# EAGLE schematic Harms Professional RAM-16-4a (EAGLE 6.6.0)
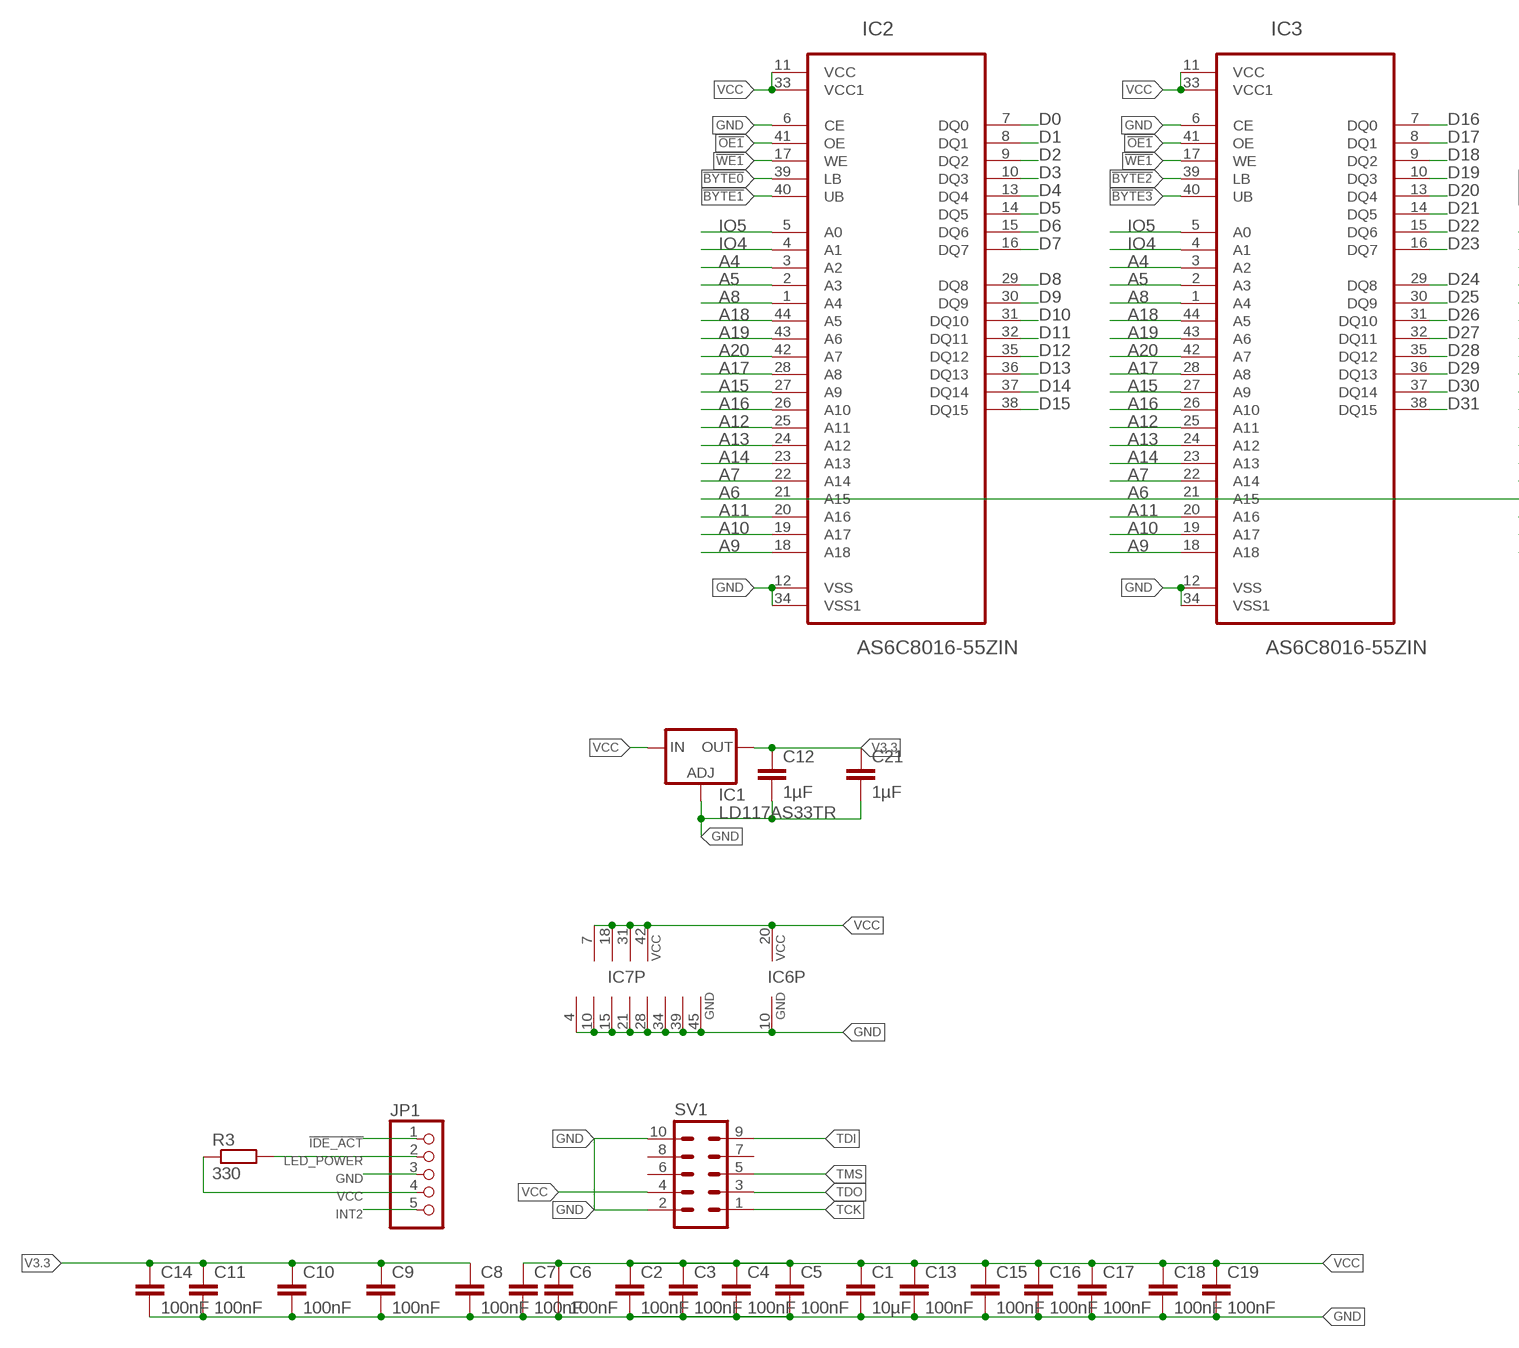
[diagram p0: schematic, sheet 1, part 1 of 2]
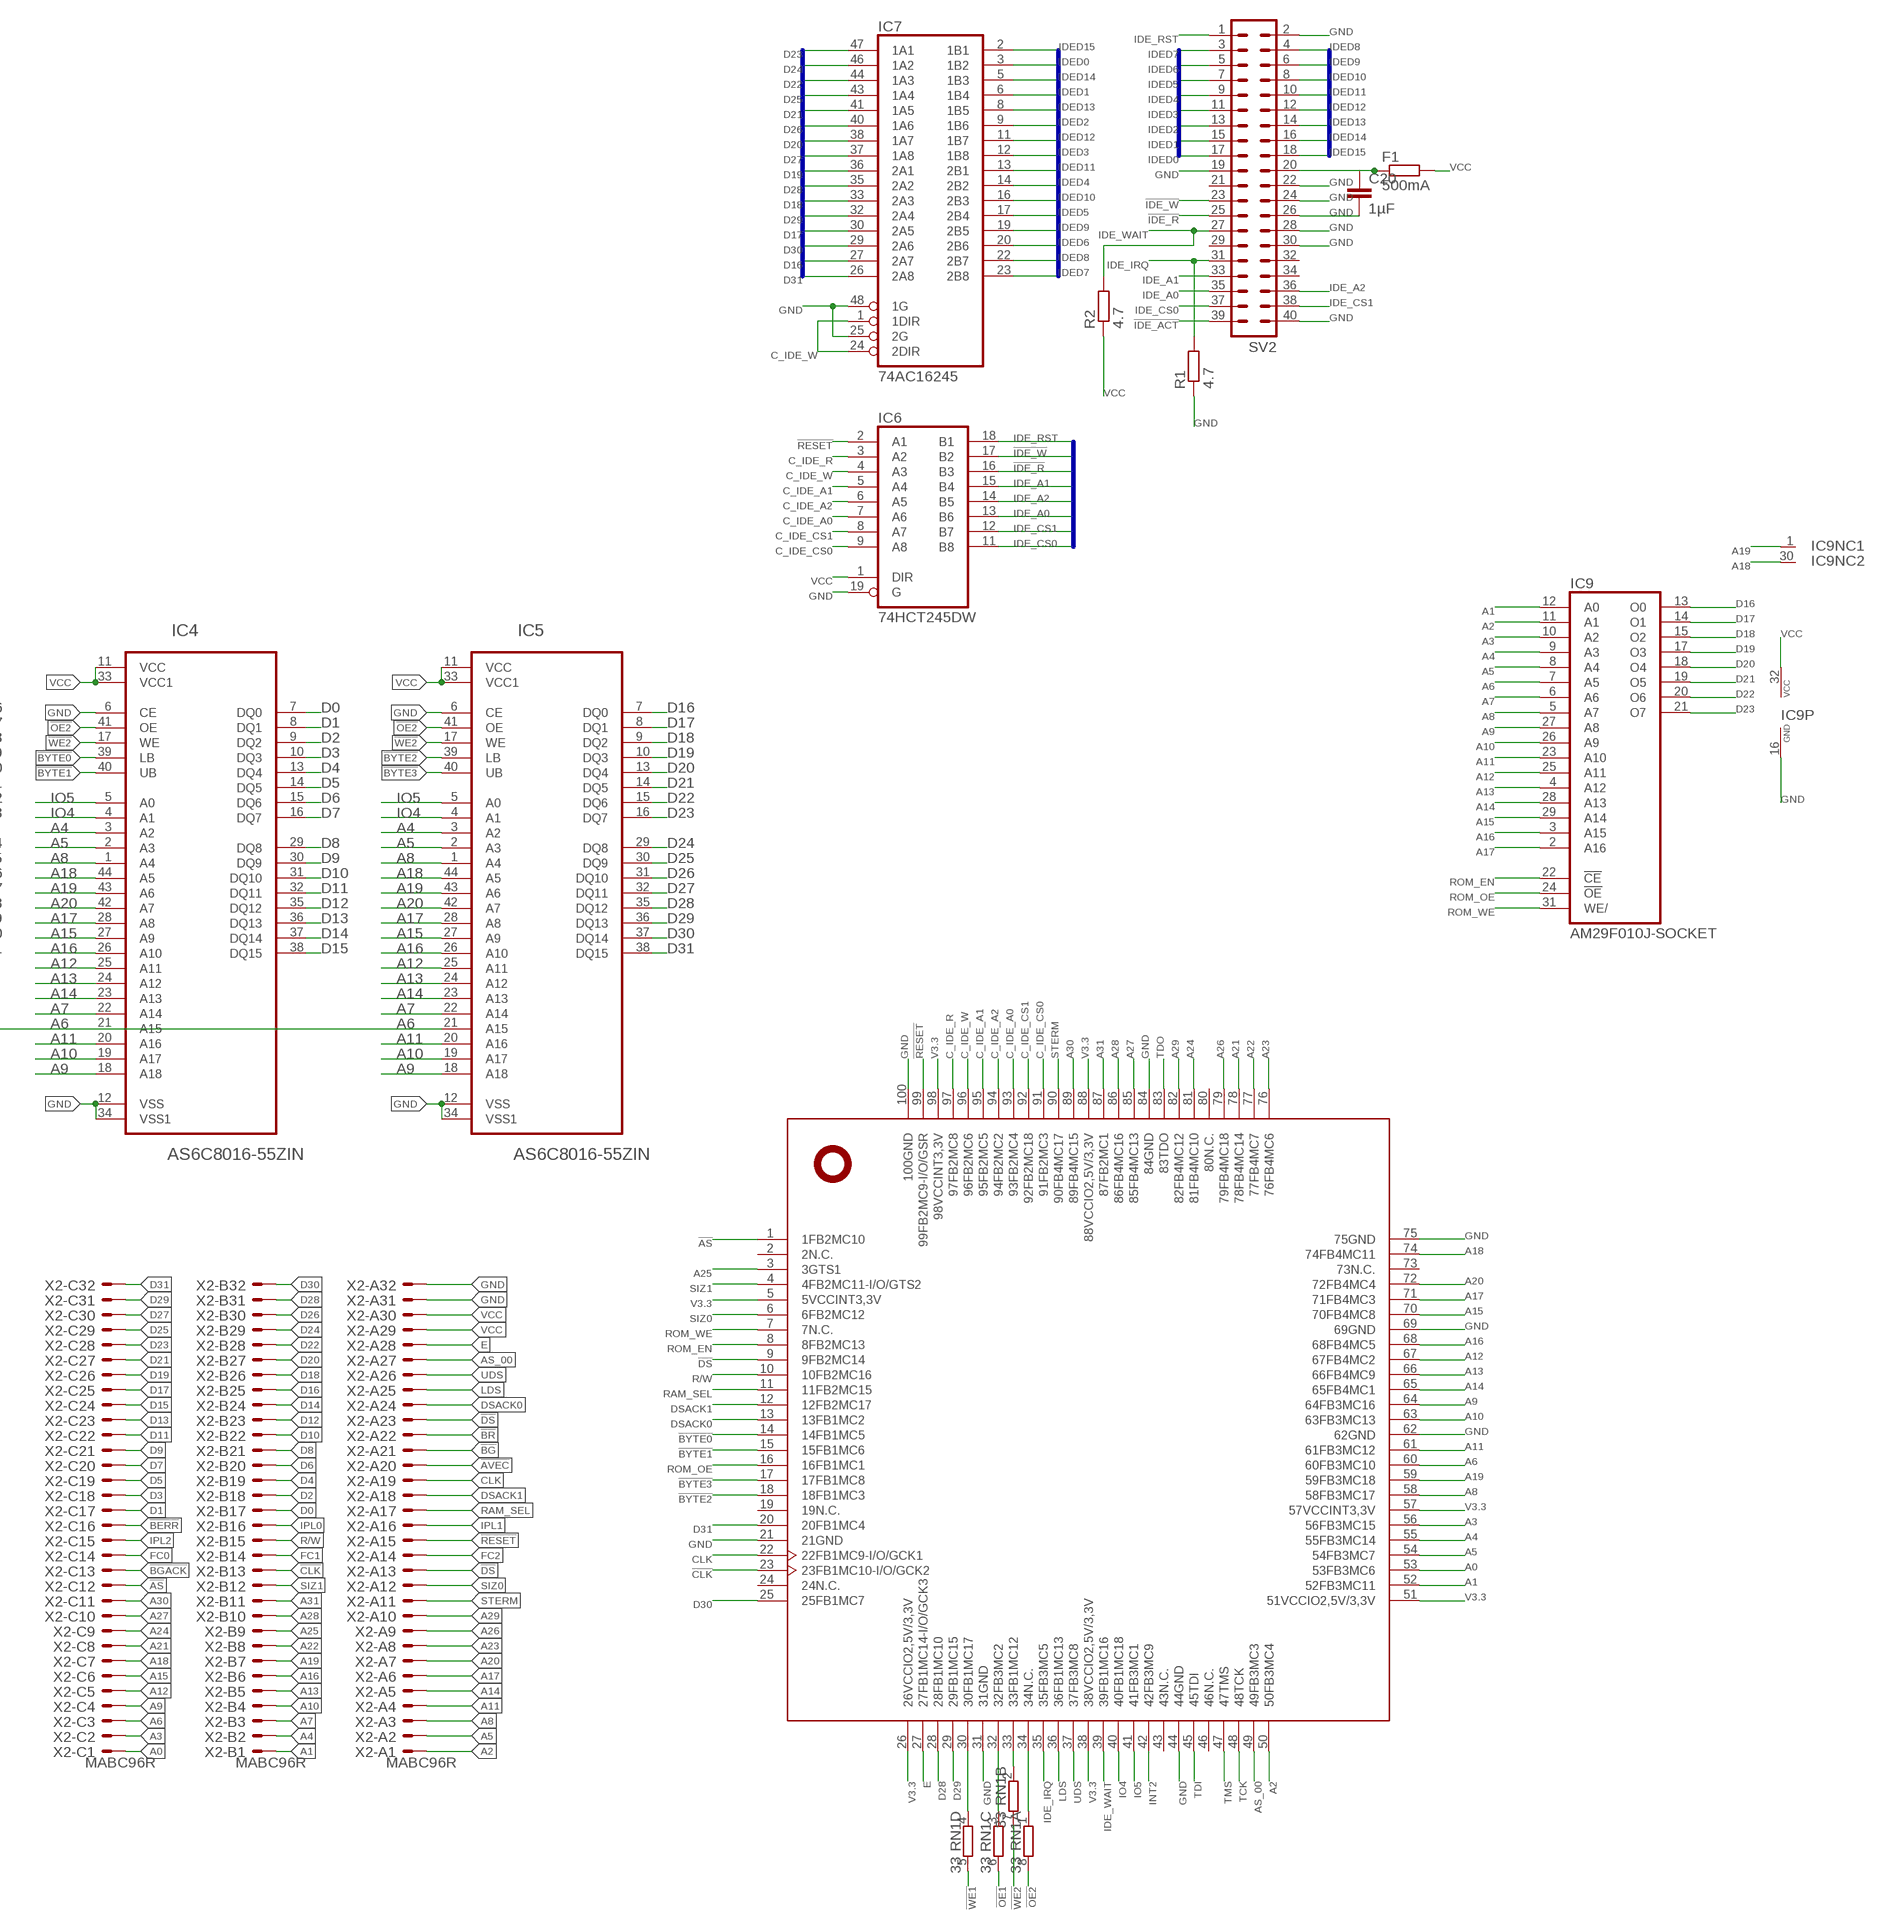
[diagram p1: schematic, sheet 1, part 2 of 2]

## Parts
C1  10µF  C-EUC0805K  [C0805K]
C2  100nF  C-EUC0603K  [C0603K]
C3  100nF  C-EUC0603K  [C0603K]
C4  100nF  C-EUC0603K  [C0603K]
C5  100nF  C-EUC0603K  [C0603K]
C6  100nF  C-EUC0603K  [C0603K]
C7  100nF  C-EUC0603K  [C0603K]
C8  100nF  C-EUC0603K  [C0603K]
C9  100nF  C-EUC0603K  [C0603K]
C10  100nF  C-EUC0603K  [C0603K]
C11  100nF  C-EUC0603K  [C0603K]
C12  1µF  C-EUC0805K  [C0805K]
C13  100nF  C-EUC0603K  [C0603K]
C14  100nF  C-EUC0603K  [C0603K]
C15  100nF  C-EUC0603K  [C0603K]
C16  100nF  C-EUC0603K  [C0603K]
C17  100nF  C-EUC0603K  [C0603K]
C18  100nF  C-EUC0603K  [C0603K]
C19  100nF  C-EUC0603K  [C0603K]
C20  1µF  C-EUC0805K  [C0805K]
C21  1µF  C-EUC0805K  [C0805K]
F1  500mA  R-EU_R2512  [R2512]
IC1  LD117AS33TR  [SOT223]
IC2  AS6C8016-55ZIN  [TSOP-2_44]
IC3  AS6C8016-55ZIN  [TSOP-2_44]
IC4  AS6C8016-55ZIN  [TSOP-2_44]
IC5  AS6C8016-55ZIN  [TSOP-2_44]
IC6  74HCT245DW  [SO20W]
IC7  74AC16245  [SSOP48DL]
IC9  AM29F010J-SOCKET  [PLCC-32-SMT-TT]
IC10  XC9572XLTQ100  [TQ100]
JP1  PINHD-1X5  [1X05]
R1  4.7  R-EU_R0603  [R0603]
R2  4.7  R-EU_R0603  [R0603]
R3  330  R-EU_R0603  [R0603]
RN1  33  4R-NCAY16  [CAY16]
SV1  ML10  [ML10]
SV2  ML40  [ML40]
X2  MABC96R  [MABC96R]

## Nets
!AS: IC10.1(1FB2MC10) X2.C12
!AVEC: X2.A20
!BERR: X2.C16
!BG: X2.A21
!BGACK: X2.C13
!BR: X2.A22
!BYTE0: IC2.39(LB) IC4.39(LB) IC10.14(14FB1MC5)
!BYTE1: IC2.40(UB) IC4.40(UB) IC10.15(15FB1MC6)
!BYTE2: IC3.39(LB) IC5.39(LB) IC10.18(18FB1MC3)
!BYTE3: IC3.40(UB) IC5.40(UB) IC10.17(17FB1MC8)
!CLK: IC10.23(23FB1MC10-I/O/GCK2) X2.B13
!DS: IC10.9(9FB2MC14) X2.A13 X2.A23
!IDE_ACT: JP1.1 SV2.39
!IDE_R: IC6.16(B3) SV2.25
!IDE_W: IC6.17(B2) SV2.23
!OE1: IC2.41(OE) IC3.41(OE) RN1.6
!OE2: IC4.41(OE) IC5.41(OE) RN1.8
!RESET: IC6.2(A1) IC10.99(99FB2MC9-I/O/GSR) X2.A15
!WE1: IC2.17(WE) IC3.17(WE) RN1.5
!WE2: IC4.17(WE) IC5.17(WE) RN1.7
A0: IC10.53(53FB3MC6) X2.C1
A1: IC9.12(A0) IC10.52(52FB3MC11) X2.B1
A2: IC9.11(A1) IC10.50(50FB3MC4) X2.A1
A3: IC9.10(A2) IC10.56(56FB3MC15) X2.C2
A4: IC2.3(A2) IC3.3(A2) IC4.3(A2) IC5.3(A2) IC9.9(A3) IC10.55(55FB3MC14) X2.B2
A5: IC2.2(A3) IC3.2(A3) IC4.2(A3) IC5.2(A3) IC9.8(A4) IC10.54(54FB3MC7) X2.A2
A6: IC2.21(A15) IC3.21(A15) IC4.21(A15) IC5.21(A15) IC9.7(A5) IC10.60(60FB3MC10) X2.C3
A7: IC2.22(A14) IC3.22(A14) IC4.22(A14) IC5.22(A14) IC9.6(A6) X2.B3
A8: IC2.1(A4) IC3.1(A4) IC4.1(A4) IC5.1(A4) IC9.5(A7) IC10.58(58FB3MC17) X2.A3
A9: IC2.18(A18) IC3.18(A18) IC4.18(A18) IC5.18(A18) IC9.27(A8) IC10.64(64FB3MC16) X2.C4
A10: IC2.19(A17) IC3.19(A17) IC4.19(A17) IC5.19(A17) IC9.26(A9) IC10.63(63FB3MC13) X2.B4
A11: IC2.20(A16) IC3.20(A16) IC4.20(A16) IC5.20(A16) IC9.23(A10) IC10.61(61FB3MC12) X2.A4
A12: IC2.25(A11) IC3.25(A11) IC4.25(A11) IC5.25(A11) IC9.25(A11) IC10.67(67FB4MC2) X2.C5
A13: IC2.24(A12) IC3.24(A12) IC4.24(A12) IC5.24(A12) IC9.4(A12) IC10.66(66FB4MC9) X2.B5
A14: IC2.23(A13) IC3.23(A13) IC4.23(A13) IC5.23(A13) IC9.28(A13) IC10.65(65FB4MC1) X2.A5
A15: IC2.27(A9) IC3.27(A9) IC4.27(A9) IC5.27(A9) IC9.29(A14) IC10.70(70FB4MC8) X2.C6
A16: IC2.26(A10) IC3.26(A10) IC4.26(A10) IC5.26(A10) IC9.3(A15) IC10.68(68FB4MC5) X2.B6
A17: IC2.28(A8) IC3.28(A8) IC4.28(A8) IC5.28(A8) IC9.2(A16) IC10.71(71FB4MC3) X2.A6
A18: IC2.44(A5) IC3.44(A5) IC4.44(A5) IC5.44(A5) IC9.30(NC) IC10.74(74FB4MC11) X2.C7
A19: IC2.43(A6) IC3.43(A6) IC4.43(A6) IC5.43(A6) IC9.1(NC) IC10.59(59FB3MC18) X2.B7
A20: IC2.42(A7) IC3.42(A7) IC4.42(A7) IC5.42(A7) IC10.72(72FB4MC4) X2.A7
A21: IC10.78(78FB4MC14) X2.C8
A22: IC10.77(77FB4MC7) X2.B8
A23: IC10.76(76FB4MC6) X2.A8
A24: IC10.81(81FB4MC10) X2.C9
A25: IC10.3(3GTS1) X2.B9
A26: IC10.79(79FB4MC18) X2.A9
A27: IC10.85(85FB4MC13) X2.C10
A28: IC10.86(86FB4MC16) X2.B10
A29: IC10.82(82FB4MC12) X2.A10
A30: IC10.89(89FB4MC15) X2.C11
A31: IC10.87(87FB2MC1) X2.B11
AS_00: IC10.49(49FB3MC3) X2.A27
C_IDE_A0: IC6.7(A6) IC10.93(93FB2MC4)
C_IDE_A1: IC6.5(A4) IC10.95(95FB2MC5)
C_IDE_A2: IC6.6(A5) IC10.94(94FB2MC2)
C_IDE_CS0: IC6.9(A8) IC10.91(91FB2MC3)
C_IDE_CS1: IC6.8(A7) IC10.92(92FB2MC18)
C_IDE_R: IC6.3(A2) IC10.97(97FB2MC8)
C_IDE_W: IC6.4(A3) IC7.1(1DIR) IC7.24(2DIR) IC10.96(96FB2MC6)
CLK: IC10.22(22FB1MC9-I/O/GCK1) X2.A19
D0: IC2.7(DQ0) IC4.7(DQ0) X2.B17
D1: IC2.8(DQ1) IC4.8(DQ1) X2.C17
D2: IC2.9(DQ2) IC4.9(DQ2) X2.B18
D3: IC2.10(DQ3) IC4.10(DQ3) X2.C18
D4: IC2.13(DQ4) IC4.13(DQ4) X2.B19
D5: IC2.14(DQ5) IC4.14(DQ5) X2.C19
D6: IC2.15(DQ6) IC4.15(DQ6) X2.B20
D7: IC2.16(DQ7) IC4.16(DQ7) X2.C20
D8: IC2.29(DQ8) IC4.29(DQ8) X2.B21
D9: IC2.30(DQ9) IC4.30(DQ9) X2.C21
D10: IC2.31(DQ10) IC4.31(DQ10) X2.B22
D11: IC2.32(DQ11) IC4.32(DQ11) X2.C22
D12: IC2.35(DQ12) IC4.35(DQ12) X2.B23
D13: IC2.36(DQ13) IC4.36(DQ13) X2.C23
D14: IC2.37(DQ14) IC4.37(DQ14) X2.B24
D15: IC2.38(DQ15) IC4.38(DQ15) X2.C24
D16: IC3.7(DQ0) IC5.7(DQ0) IC7.27(2A7) IC9.13(O0) X2.B25
D17: IC3.8(DQ1) IC5.8(DQ1) IC7.30(2A5) IC9.14(O1) X2.C25
D18: IC3.9(DQ2) IC5.9(DQ2) IC7.33(2A3) IC9.15(O2) X2.B26
D19: IC3.10(DQ3) IC5.10(DQ3) IC7.36(2A1) IC9.17(O3) X2.C26
D20: IC3.13(DQ4) IC5.13(DQ4) IC7.38(1A7) IC9.18(O4) X2.B27
D21: IC3.14(DQ5) IC5.14(DQ5) IC7.41(1A5) IC9.19(O5) X2.C27
D22: IC3.15(DQ6) IC5.15(DQ6) IC7.44(1A3) IC9.20(O6) X2.B28
D23: IC3.16(DQ7) IC5.16(DQ7) IC7.47(1A1) IC9.21(O7) X2.C28
D24: IC3.29(DQ8) IC5.29(DQ8) IC7.46(1A2) X2.B29
D25: IC3.30(DQ9) IC5.30(DQ9) IC7.43(1A4) X2.C29
D26: IC3.31(DQ10) IC5.31(DQ10) IC7.40(1A6) X2.B30
D27: IC3.32(DQ11) IC5.32(DQ11) IC7.37(1A8) X2.C30
D28: IC3.35(DQ12) IC5.35(DQ12) IC7.35(2A2) IC10.28(28FB1MC10) X2.B31
D29: IC3.36(DQ13) IC5.36(DQ13) IC7.32(2A4) IC10.29(29FB1MC15) X2.C31
D30: IC3.37(DQ14) IC5.37(DQ14) IC7.29(2A6) IC10.25(25FB1MC7) X2.B32
D31: IC3.38(DQ15) IC5.38(DQ15) IC7.26(2A8) IC10.20(20FB1MC4) X2.C32
DSACK0: IC10.13(13FB1MC2) X2.A24
DSACK1: IC10.12(12FB2MC17) X2.A18
E: IC10.27(27FB1MC14-I/O/GCK3) X2.A28
FC0: X2.C14
FC1: X2.B14
FC2: X2.A14
GND: C1.2 C2.2 C3.2 C4.2 C5.2 C6.2 C7.2 C8.2 C9.2 C10.2 C11.2 C12.2 C13.2 C14.2 C15.2 C16.2 C17.2 C18.2 C19.2 C20.2 C21.2 IC1.1(ADJ) IC2.6(CE) IC2.12(VSS) IC2.34(VSS1) IC3.6(CE) IC3.12(VSS) IC3.34(VSS1) IC4.6(CE) IC4.12(VSS) IC4.34(VSS1) IC5.6(CE) IC5.12(VSS) IC5.34(VSS1) IC6.10(GND) IC6.19(G) IC7.4(GND) IC7.10(GND) IC7.15(GND) IC7.21(GND) IC7.25(2G) IC7.28(GND) IC7.34(GND) IC7.39(GND) IC7.45(GND) IC7.48(1G) IC9.16(GND) IC10.21(21GND) IC10.31(31GND) IC10.44(44GND) IC10.62(62GND) IC10.69(69GND) IC10.75(75GND) IC10.84(84GND) IC10.100(100GND) JP1.3 R1.1 SV1.2 SV1.10 SV2.2 SV2.19 SV2.22 SV2.24 SV2.26 SV2.28 SV2.30 SV2.40 X2.A31 X2.A32
IDE_A0: IC6.13(B6) SV2.35
IDE_A1: IC6.15(B4) SV2.33
IDE_A2: IC6.14(B5) SV2.36
IDE_CS0: IC6.11(B8) SV2.37
IDE_CS1: IC6.12(B7) SV2.38
IDE_IRQ: IC10.35(35FB3MC5) R1.2 SV2.31
IDE_RST: IC6.18(B1) SV2.1
IDE_WAIT: IC10.39(39FB1MC16) R2.2 SV2.27
IDED0: IC7.3(1B2) SV2.17
IDED1: IC7.6(1B4) SV2.15
IDED2: IC7.9(1B6) SV2.13
IDED3: IC7.12(1B8) SV2.11
IDED4: IC7.14(2B2) SV2.9
IDED5: IC7.17(2B4) SV2.7
IDED6: IC7.20(2B6) SV2.5
IDED7: IC7.23(2B8) SV2.3
IDED8: IC7.22(2B7) SV2.4
IDED9: IC7.19(2B5) SV2.6
IDED10: IC7.16(2B3) SV2.8
IDED11: IC7.13(2B1) SV2.10
IDED12: IC7.11(1B7) SV2.12
IDED13: IC7.8(1B5) SV2.14
IDED14: IC7.5(1B3) SV2.16
IDED15: IC7.2(1B1) SV2.18
INT2: IC10.42(42FB3MC9) JP1.5
IO4: IC2.4(A1) IC3.4(A1) IC4.4(A1) IC5.4(A1) IC10.40(40FB1MC18)
IO5: IC2.5(A0) IC3.5(A0) IC4.5(A0) IC5.5(A0) IC10.41(41FB3MC1)
IPL0: X2.B16
IPL1: X2.A16
IPL2: X2.C15
KEY_PIN_POWER: C20.1 F1.1 SV2.20
LDS: IC10.36(36FB1MC13) X2.A25
LED_POWER: JP1.2 R3.2
N$1: IC10.30(30FB1MC17) RN1.4
N$2: IC10.34(34N.C.) RN1.1
N$3: IC10.33(33FB1MC12) RN1.2
N$4: IC10.32(32FB3MC2) RN1.3
R/W: IC10.10(10FB2MC16) X2.B15
RAM_SEL: IC10.11(11FB2MC15) X2.A17
ROM_EN: IC9.22(!CE) IC10.8(8FB2MC13)
ROM_OE: IC9.24(!OE) IC10.16(16FB1MC1)
ROM_WE: IC9.31(WE/) IC10.7(7N.C.)
SIZ0: IC10.6(6FB2MC12) X2.A12
SIZ1: IC10.4(4FB2MC11-I/O/GTS2) X2.B12
STERM: IC10.90(90FB4MC17) X2.A11
TCK: IC10.48(48TCK) SV1.1
TDI: IC10.45(45TDI) SV1.9
TDO: IC10.83(83TDO) SV1.3
TMS: IC10.47(47TMS) SV1.5
UDS: IC10.37(37FB3MC8) X2.A26
V3.3: C8.1 C9.1 C10.1 C11.1 C12.1 C14.1 C21.1 IC1.4(OUT) IC10.5(5VCCINT3,3V) IC10.26(26VCCIO2,5V/3,3V) IC10.38(38VCCIO2,5V/3,3V) IC10.51(51VCCIO2,5V/3,3V) IC10.57(57VCCINT3,3V) IC10.88(88VCCIO2,5V/3,3V) IC10.98(98VCCINT3,3V)
VCC: C1.1 C2.1 C3.1 C4.1 C5.1 C6.1 C7.1 C13.1 C15.1 C16.1 C17.1 C18.1 C19.1 F1.2 IC1.3(IN) IC2.11(VCC) IC2.33(VCC1) IC3.11(VCC) IC3.33(VCC1) IC4.11(VCC) IC4.33(VCC1) IC5.11(VCC) IC5.33(VCC1) IC6.1(DIR) IC6.20(VCC) IC7.7(VCC) IC7.18(VCC) IC7.31(VCC) IC7.42(VCC) IC9.32(VCC) JP1.4 R2.1 R3.1 SV1.4 X2.A29 X2.A30
Unconnected: IC10.2(2N.C.) IC10.19(19N.C.) IC10.24(24N.C.) IC10.43(43N.C.) IC10.46(46N.C.) IC10.73(73N.C.) IC10.80(80N.C.) SV1.6 SV1.7 SV1.8 SV2.21 SV2.29 SV2.32 SV2.34

## Buses
IDED[0..15]
D[0..31]
IDE_RST,IDE_A[0..2],IDE_CS[0..1],!IDE_R,!IDE_W

## Library data of the parts
C1-C21 = rcl:C-EU: CAPACITOR, European symbol
F1 R1-R3 = rcl:R-EU_: RESISTOR, European symbol
IC1 = v-reg:LD117A?*: Low drop fixed and adjustable positive voltage regulators 1 A Source: http://www.st.com/stonline/products/literature/ds/7194/ld1117axx.pdf
IC2-IC5 = Alliance_Memory_By_element14_Batch_1:AS6C8016-55ZIN
IC6 = 74xx-eu:74*245: Octal BUS TRANSCEIVER, 3-state
IC7 = 74ac-logic:74AC16245: 16-bit BUS TRANSCEIVER, 3-state
IC9 = am29-memory:AM29F010*: 1-Megabit FLASH MEMORY (128 K x 8 bit) 5 V-only
IC10 = xilinx_xc9572xl-tq100:XC9572XLTQ100
JP1 = pinhead:PINHD-1X5: PIN HEADER
RN1 = resistor-dil:4R-N: Array Chip Resistor Source: RS Component / Phycomp; OC_FARNELL: unknown; OC_NEWARK: unknown
SV1 = con-harting-ml:ML10: HARTING; OC_FARNELL: unknown; OC_NEWARK: unknown
SV2 = con-harting-ml:ML40: HARTING; OC_FARNELL: unknown; OC_NEWARK: unknown
X2 = con-vg:MABC96R: CONNECTOR male, 96 pins, type R, rows ABC, grid 2.54 mm